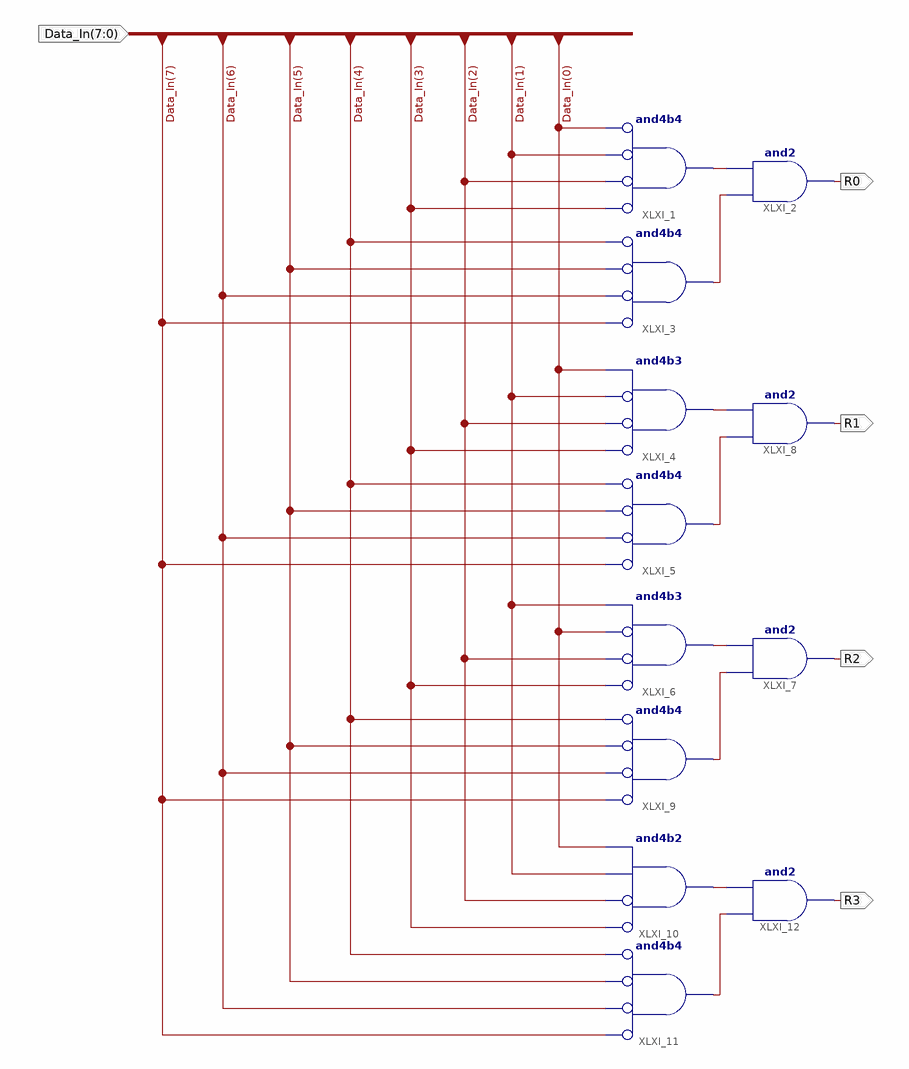
[diagram p0: schematic sheet 1]
// Xilinx ISE schematic STA_Decoder.sch (spartan3e) as structural Verilog: 12 symbols, 5 ports
module STA_Decoder (
  input  [7:0] Data_In,
  output R0,
  output R3,
  output R1,
  output R2
);

  wire XLXN_2, XLXN_5, XLXN_8, XLXN_11, XLXN_16, XLXN_17, XLXN_18, XLXN_25;

  and XLXI_1 (XLXN_2, ~Data_In[3], ~Data_In[2], ~Data_In[1], ~Data_In[0]);  // and4b4
  and XLXI_2 (R0, XLXN_5, XLXN_2);
  and XLXI_3 (XLXN_5, ~Data_In[7], ~Data_In[6], ~Data_In[5], ~Data_In[4]);  // and4b4
  and XLXI_4 (XLXN_8, ~Data_In[3], ~Data_In[2], ~Data_In[1], Data_In[0]);  // and4b3
  and XLXI_5 (XLXN_17, ~Data_In[7], ~Data_In[6], ~Data_In[5], ~Data_In[4]);  // and4b4
  and XLXI_6 (XLXN_11, ~Data_In[3], ~Data_In[2], ~Data_In[0], Data_In[1]);  // and4b3
  and XLXI_7 (R2, XLXN_16, XLXN_11);
  and XLXI_8 (R1, XLXN_17, XLXN_8);
  and XLXI_9 (XLXN_16, ~Data_In[7], ~Data_In[6], ~Data_In[5], ~Data_In[4]);  // and4b4
  and XLXI_10 (XLXN_18, ~Data_In[3], ~Data_In[2], Data_In[1], Data_In[0]);  // and4b2
  and XLXI_11 (XLXN_25, ~Data_In[7], ~Data_In[6], ~Data_In[5], ~Data_In[4]);  // and4b4
  and XLXI_12 (R3, XLXN_25, XLXN_18);
endmodule
